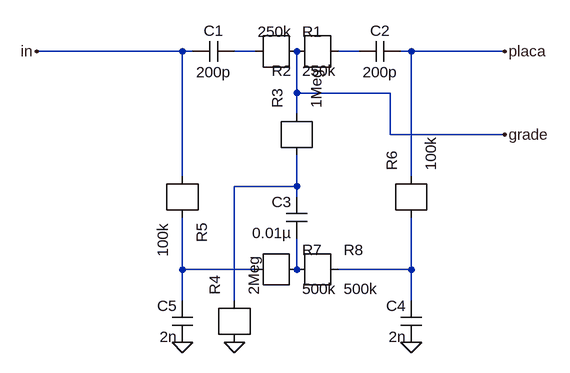
[diagram p0: schematic filtro ativo brimar.asc]
filtro ativo brimar.asc, the LTspice schematic file:
Version 4
SHEET 1 880 808
WIRE 160 208 -64 208
WIRE 176 208 160 208
WIRE 272 208 240 208
WIRE 432 208 400 208
WIRE 512 208 496 208
WIRE 656 208 512 208
WIRE 336 272 336 208
WIRE 480 272 336 272
WIRE 336 304 336 272
WIRE 480 336 480 272
WIRE 656 336 480 336
WIRE 160 400 160 208
WIRE 512 400 512 208
WIRE 336 416 336 368
WIRE 336 416 240 416
WIRE 336 432 336 416
WIRE 160 544 160 464
WIRE 272 544 160 544
WIRE 336 544 336 496
WIRE 512 544 512 464
WIRE 512 544 400 544
WIRE 160 592 160 544
WIRE 240 592 240 416
WIRE 512 592 512 544
FLAG 656 208 placa
FLAG 656 336 grade
FLAG 240 656 0
FLAG 160 656 0
FLAG -64 208 in
FLAG 512 656 0
SYMBOL cap 240 192 R90
WINDOW 0 0 32 VBottom 2
WINDOW 3 32 32 VTop 2
SYMATTR InstName C1
SYMATTR Value 200p
SYMBOL cap 496 192 R90
WINDOW 0 0 32 VBottom 2
WINDOW 3 32 32 VTop 2
SYMATTR InstName C2
SYMATTR Value 200p
SYMBOL r 272 208 R0
SYMATTR InstName R1
SYMATTR Value 250k
SYMBOL r 400 208 R180
SYMATTR InstName R2
SYMATTR Value 250k
SYMBOL r 336 368 R270
SYMATTR InstName R3
SYMATTR Value 1Meg
SYMBOL cap 352 496 R180
WINDOW 0 24 56 Left 2
WINDOW 3 24 8 Left 2
SYMATTR InstName C3
SYMATTR Value 0.01µ
SYMBOL r 240 656 R270
SYMATTR InstName R4
SYMATTR Value 2Meg
SYMBOL r 160 400 R90
SYMATTR InstName R5
SYMATTR Value 100k
SYMBOL r 512 464 R270
SYMATTR InstName R6
SYMATTR Value 100k
SYMBOL cap 528 656 R180
WINDOW 0 24 56 Left 2
WINDOW 3 24 8 Left 2
SYMATTR InstName C4
SYMATTR Value 2n
SYMBOL cap 176 656 R180
WINDOW 0 24 56 Left 2
WINDOW 3 24 8 Left 2
SYMATTR InstName C5
SYMATTR Value 2n
SYMBOL r 272 544 R0
SYMATTR InstName R7
SYMATTR Value 500k
SYMBOL r 336 544 R0
SYMATTR InstName R8
SYMATTR Value 500k

The netlist it stands for:
* filtro ativo brimar.asc
C1 N001 in 200p
C2 placa N002 200p
R1 grade N001 250k
R2 grade N002 250k
R3 grade N003 1Meg
C3 N005 N003 0.01µ
R4 N003 0 2Meg
R5 N004 in 100k
R6 placa N006 100k
C4 0 N006 2n
C5 0 N004 2n
R7 N005 N004 500k
R8 N006 N005 500k
.backanno
.end